# EAGLE design rev1 (EAGLE 6.5.0)
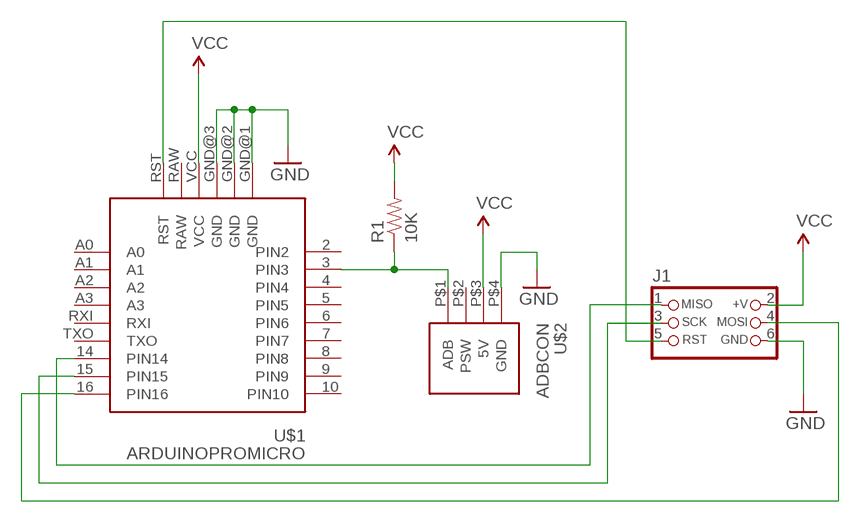
[diagram p0: schematic, sheet 1]

## Parts
J1  CON_HEADER_PRG_AVR_ICSP-PTH  [HEADER_PRG_2X03]
R1  10K  RESISTOR1206  [1206]
U$1  ARDUINOPROMICRO  [DIP]
U$2  ADBCON  [ADBCON]

## Nets
GND: J1.6(GND) U$1.GND@1(GND) U$1.GND@2(GND) U$1.GND@3(GND) U$2.P$4(GND)
N$1: R1.1 U$1.3(PIN3) U$2.P$1(ADB)
N$2: J1.3(SCK) U$1.15(PIN15)
N$3: J1.5(RST) U$1.RST
N$4: J1.1(MISO) U$1.14(PIN14)
N$5: J1.4(MOSI) U$1.16(PIN16)
VCC: J1.2(+V) R1.2 U$1.VCC U$2.P$3(5V)
Unconnected: U$1.2(PIN2) U$1.4(PIN4) U$1.5(PIN5) U$1.6(PIN6) U$1.7(PIN7) U$1.8(PIN8) U$1.9(PIN9) U$1.10(PIN10) U$1.A0 U$1.A1 U$1.A2 U$1.A3 U$1.RAW U$1.RXI U$1.TXO U$2.P$2(PSW)

## Library data of the parts
J1 = dp_devices:CON_HEADER_PRG_AVR_ICSP: 2x3 AVR ICSP programming header
R1 = SparkFun-Passives:RESISTOR: Resistor Basic schematic elements and footprints for 0603, 1206, and PTH resistors.
U$1 = Arduino:ARDUINOPROMICRO: Arduino Pro Micro module from SparkFun
U$2 = Connectors:ADBCON: ADB connector / eBay MINI-DIN 4

## Board
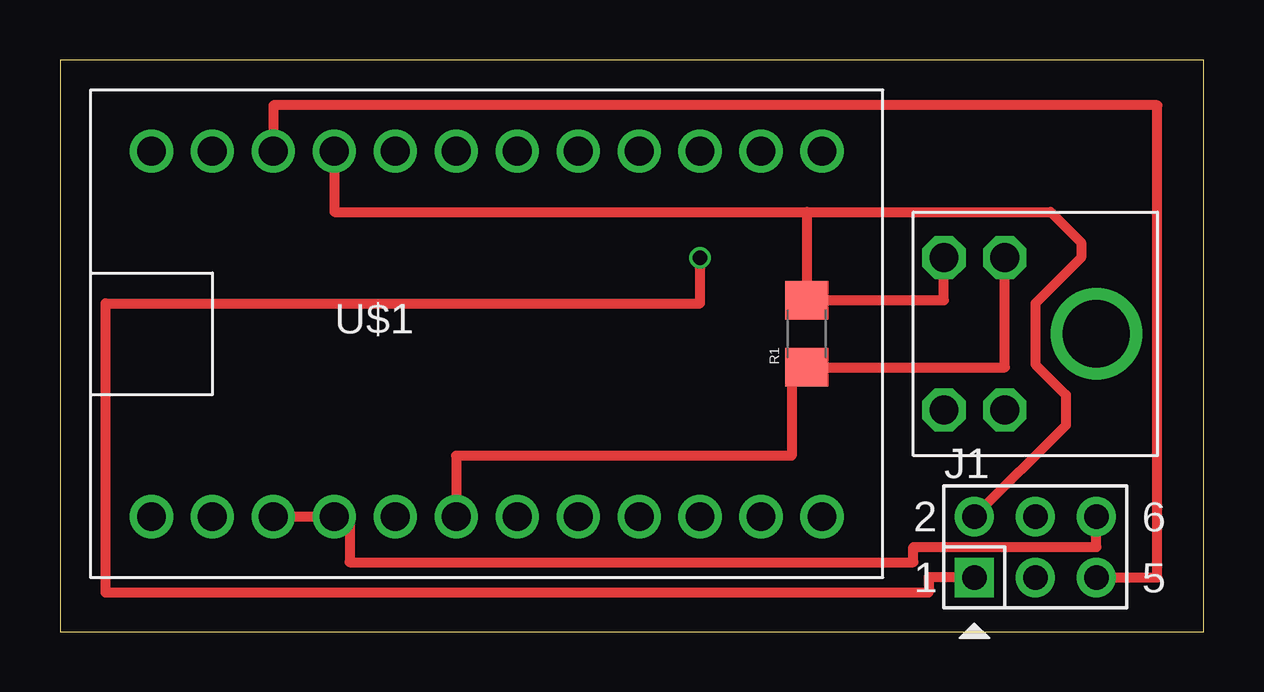
[diagram p1: board, top side]
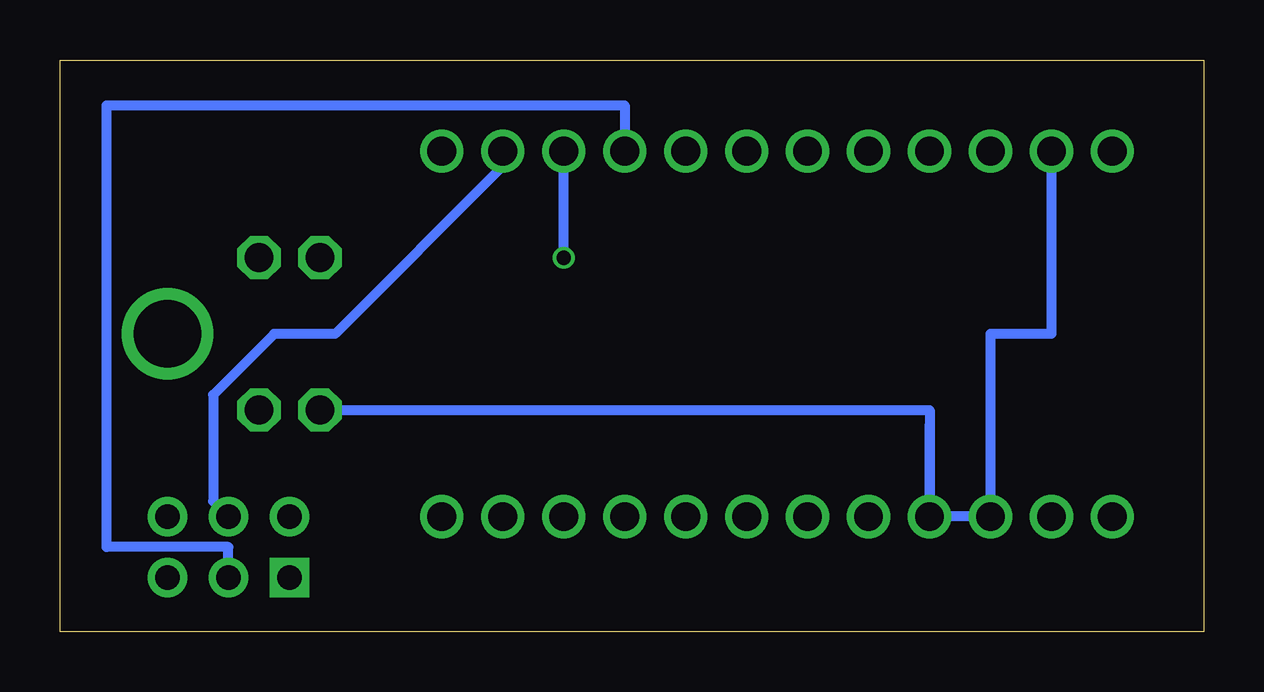
[diagram p2: board, bottom side, seen from below]

Size 47.66 x 23.85 mm. Coordinates in mm from the lower left corner, seen from the top.
Outline: 0,0 47.66,0 47.66,23.85 0,23.85 0,0
Copper layers (1*16): Top 0.035mm / dielectric 1.5mm / Bottom 0.035mm
Design rules "dirt_cheap_dirty_boards.v1": minimum track width 5mil, minimum drill 12mil, track to track 5mil, track to pad 5mil, pad to pad 5mil, via to via 5mil, smd to smd 0mil, copper to edge 10mil, drill to drill 10mil, minimum pad ring 10mil, minimum via ring 6mil, stop-mask expansion 2mil, vias tented up to drill 25mil, thermal gap 10mil

### Footprints (pad centres in the part's own frame; a part is rotated, then mirrored left to right if it is on the bottom)
HEADER_PRG_2X03 = drill 1.02 pad 1.632 square: 1 -2.54,-1.27 | drill 1.02 pad 1.632: 2 -2.54,1.27; 3 0,-1.27; 4 0,1.27; 5 2.54,-1.27; 6 2.54,1.27
1206 = smd 1.6 x 1.8: 1 -1.4,0; 2 1.4,0
DIP = drill 1.2: 2 10.16,0; 3 12.7,0; 4 15.24,0; 5 17.78,0; 6 20.32,0; 7 22.86,0; 8 25.4,0; 9 27.94,0; 10 27.94,15.24; 14 22.86,15.24; 15 20.32,15.24; 16 25.4,15.24; A0 17.78,15.24; A1 15.24,15.24; A2 12.7,15.24; A3 10.16,15.24; GND@1 5.08,0; GND@2 7.62,0; GND@3 2.54,15.24; RAW 0,15.24; RST 5.08,15.24; RXI 2.54,0; TXO 0,0; VCC 7.62,15.24
ADBCON = drill 1.2 octagon: P$1 0,6.35; P$2 0,0; P$3 -2.54,6.35; P$4 -2.54,0 | drill 2.8: P$5 3.81,3.175

### Placement (x,y rotation side)
J1  40.64,3.54 0 top
R1  31.11,12.43 90 top
U$1  3.81,4.81 0 top
U$2  39.37,9.26 0 top

### Tracks (layer width: path | path; a pad name or v marks a point on that pad's centre or on a via)
GND
  Top 0.406: U$1.GND@1 12.06,4.81 12.06,2.91 35.56,2.91 35.56,3.54 43.18,3.54 J1.6
  Bottom 0.406: U$1.GND@3 6.35,12.43 8.89,12.43 U$1.GND@1 U$1.GND@2 | U$1.GND@2 11.43,8.62 | U$2.P$4 11.43,9.26 U$1.GND@2
N$1
  Top 0.406: U$2.P$1 39.37,11.03 R1.1 30.48,11.03 30.48,7.35 16.51,7.35 U$1.3
N$2
  Bottom 0.406: J1.3 40.64,3.54 45.72,3.54 45.72,21.95 24.13,21.95 U$1.15
N$3
  Top 0.406: J1.5 45.72,2.27 45.72,21.95 8.89,21.95 U$1.RST
N$4  (via drill 0.6)
  Top 0.406: J1.1 36.2,2.27 36.2,1.64 1.91,1.64 1.91,13.7 26.67,13.7 v26.67,15.61
  Bottom 0.406: v26.67,15.61 U$1.14
N$5
  Bottom 0.406: U$1.16 29.21,19.41 36.2,12.43 38.73,12.43 41.27,9.89 41.27,5.45 J1.4
VCC
  Top 0.406: U$1.VCC 11.43,17.51 31.11,17.51 | 31.11,17.51 R1.2 36.83,13.83 U$2.P$3 | 31.11,17.51 41.27,17.51 42.55,16.24 42.55,15.61 40.64,13.7 40.64,11.16 41.91,9.89 41.91,8.62 J1.2

### Text on the board
bDocu: http://tibounise.com | ADB/USB | revision 0x1/batch 0x0